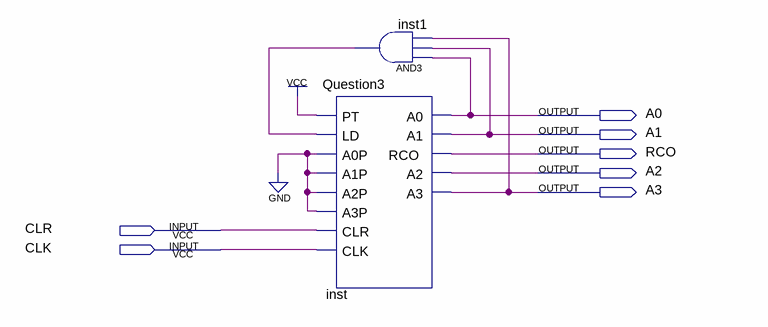
[diagram p0: schematic sheet]
// Quartus schematic Question3p2.bdf as structural Verilog: 2 symbols, 7 pins
module Question3p2 (
  input  CLR,
  input  CLK,
  output A0,
  output A1,
  output RCO,
  output A2,
  output A3
);

  wire inst1_out;

  and inst1 (inst1_out, A0, A1, A3);
  Question3 inst (
    .PT(1'b1), .LD(inst1_out), .A0P(1'b0), .A1P(1'b0), .A2P(1'b0), .A3P(1'b0), .CLR(CLR), .CLK(CLK), .A0(A0),
    .A1(A1), .RCO(RCO), .A2(A2), .A3(A3));
endmodule
